# EasyEDA Pro project MSDRV4.eprj, schematic BBC_2024_REUSE
Board Name: BBC_2024_REUSE; Create Date: 2025-01-27; Page Name: P1; Project Name: MSDRV4; Schematic Name: BBC_2024_REUSE; Update Date: 2025-03-30; Company: EasyEDA.com; Page Size: A4; Version: V1.0
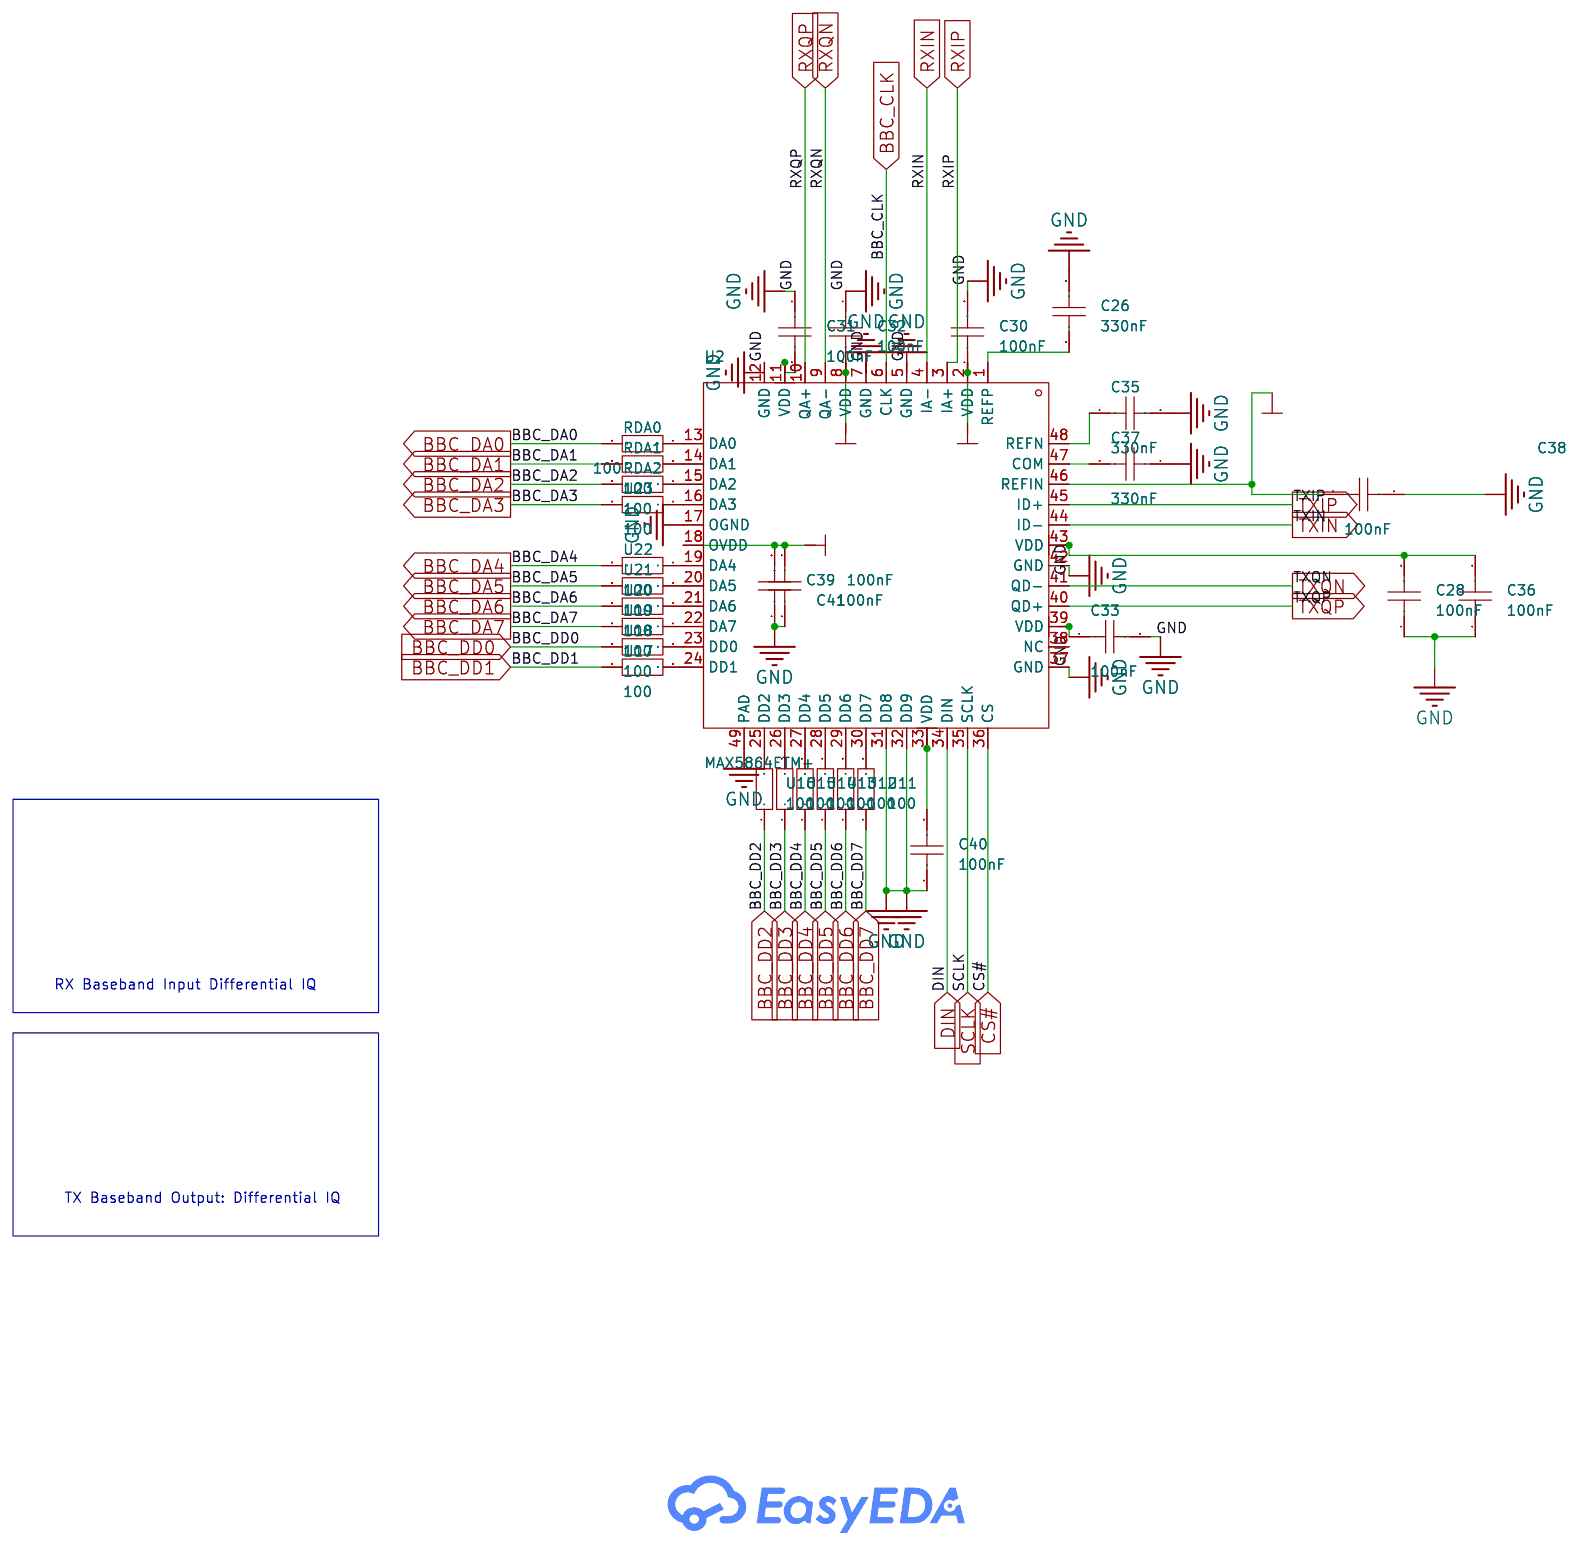
[diagram p1: schematic sheet]

## Parts
C26  330nF  [C0805]
C28  100nF  [C0805]
C30  100nF  [C0805]
C31  100nF  [C0805]
C32  100nF  [C0805]
C33  100nF  [C0805]
C35  330nF  [C0805]
C36  100nF  [C0805]
C37  330nF  [C0805]
C38  100nF  [C0805]
C39  100nF  [C0805]
C40  100nF  [C0805]
C41  100nF  [C0805]
RDA0  100  [R0805]
RDA1  100  [R0805]
RDA2  100  [R0805]
U2  MAX5864ETM+  [QFN-48_L7.0-W7.0-P0.50-BL-EP5.1]
U11  100  [R0805]
U12  100  [R0805]
U13  100  [R0805]
U14  100  [R0805]
U15  100  [R0805]
U16  100  [R0805]
U17  100  [R0805]
U18  100  [R0805]
U19  100  [R0805]
U20  100  [R0805]
U21  100  [R0805]
U22  100  [R0805]
U23  100  [R0805]

## Library data of the parts
C26 C28 C30-C33 C35-C41 = CAP_0805: Supplier Footprint: 0805
RDA0-RDA2 U11-U23 = 3R00: Supplier Part: C9900008006; JLCPCB Part Class: Extended Part; Supplier: LCSC
U2 = MAX5864ETM+: Supply Voltage:2.7V~3.3V Supply Voltage:2.7V~3.3V; LCSC Part Name: MAX5864ETM; Supplier Part: C143525; Manufacturer: ADI(亚德诺)/MAXIM(美信); Supplier Footprint: QFN-48-EP(7x7); JLCPCB Part Class: Extended Part; Datasheet: https://atta.szlcsc.com/upload/public/pdf/source/20171204/C143525_15123772477351162683.pdf; Supplier: LCSC; Supply Voltage: 2.7V~3.3V

## Nets
GND: C26.1 C28.1 C30.2 C31.1 C32.1 C33.2 C35.2 C36.1 C37.1 C38.1 C39.1 C40.1 C41.1 U2.5(GND) U2.7(GND) U2.12(GND) U2.17(OGND) U2.31(DD8) U2.32(DD9) U2.37(GND) U2.42(GND) U2.49(PAD)
3.3: C28.2 C30.1 C31.2 C32.2 C33.1 C36.2 C38.2 C39.2 C40.2 C41.2 U2.2(VDD) U2.8(VDD) U2.11(VDD) U2.18(OVDD) U2.33(VDD) U2.39(VDD) U2.43(VDD) U2.46(REFIN)
BBC_CLK: U2.6(CLK)
BBC_DA0: RDA0.2
BBC_DA1: RDA1.2
BBC_DA2: RDA2.2
BBC_DA3: U23.2
BBC_DA4: U22.2
BBC_DA5: U21.2
BBC_DA6: U20.2
BBC_DA7: U19.2
BBC_DD0: U18.2
BBC_DD1: U17.2
BBC_DD2: U16.1
BBC_DD3: U15.1
BBC_DD4: U14.1
BBC_DD5: U13.1
BBC_DD6: U12.1
BBC_DD7: U11.1
CS#: U2.36(CS)
DIN: U2.34(DIN)
RXIN: U2.4(IA-)
RXIP: U2.3(IA+)
RXQN: U2.9(QA-)
RXQP: U2.10(QA+)
SCLK: U2.35(SCLK)
TXIN: U2.44(ID-)
TXIP: U2.45(ID+)
TXQN: U2.41(QD-)
TXQP: U2.40(QD+)
$1N1602: C37.2 U2.47(COM)
$1N1605: U2.30(DD7) U11.2
$1N1608: U2.29(DD6) U12.2
$1N1611: U2.28(DD5) U13.2
$1N1614: U2.27(DD4) U14.2
$1N1617: U2.26(DD3) U15.2
$1N1620: U2.25(DD2) U16.2
$1N1625: U2.24(DD1) U17.1
$1N1628: U2.23(DD0) U18.1
$1N1633: U2.21(DA6) U20.1
$1N1636: U2.20(DA5) U21.1
$1N1639: U2.19(DA4) U22.1
$1N1642: U2.16(DA3) U23.1
$1N1653: C35.1 U2.48(REFN)
$1N1654: C26.2 U2.1(REFP)
$1N1662: U2.22(DA7) U19.1
Net-(RDA0-1): RDA0.1 U2.13(DA0)
Net-(RDA1-1): RDA1.1 U2.14(DA1)
Net-(RDA2-1): RDA2.1 U2.15(DA2)

Not connected (* = marked no-connect by the designer): U2 38(NC)

## Notes on the sheet
- RX Baseband Input Differential IQ
- TX Baseband Output: Differential IQ
